# Altium project BMW E34 Touring Bagage Light.PrjPcb
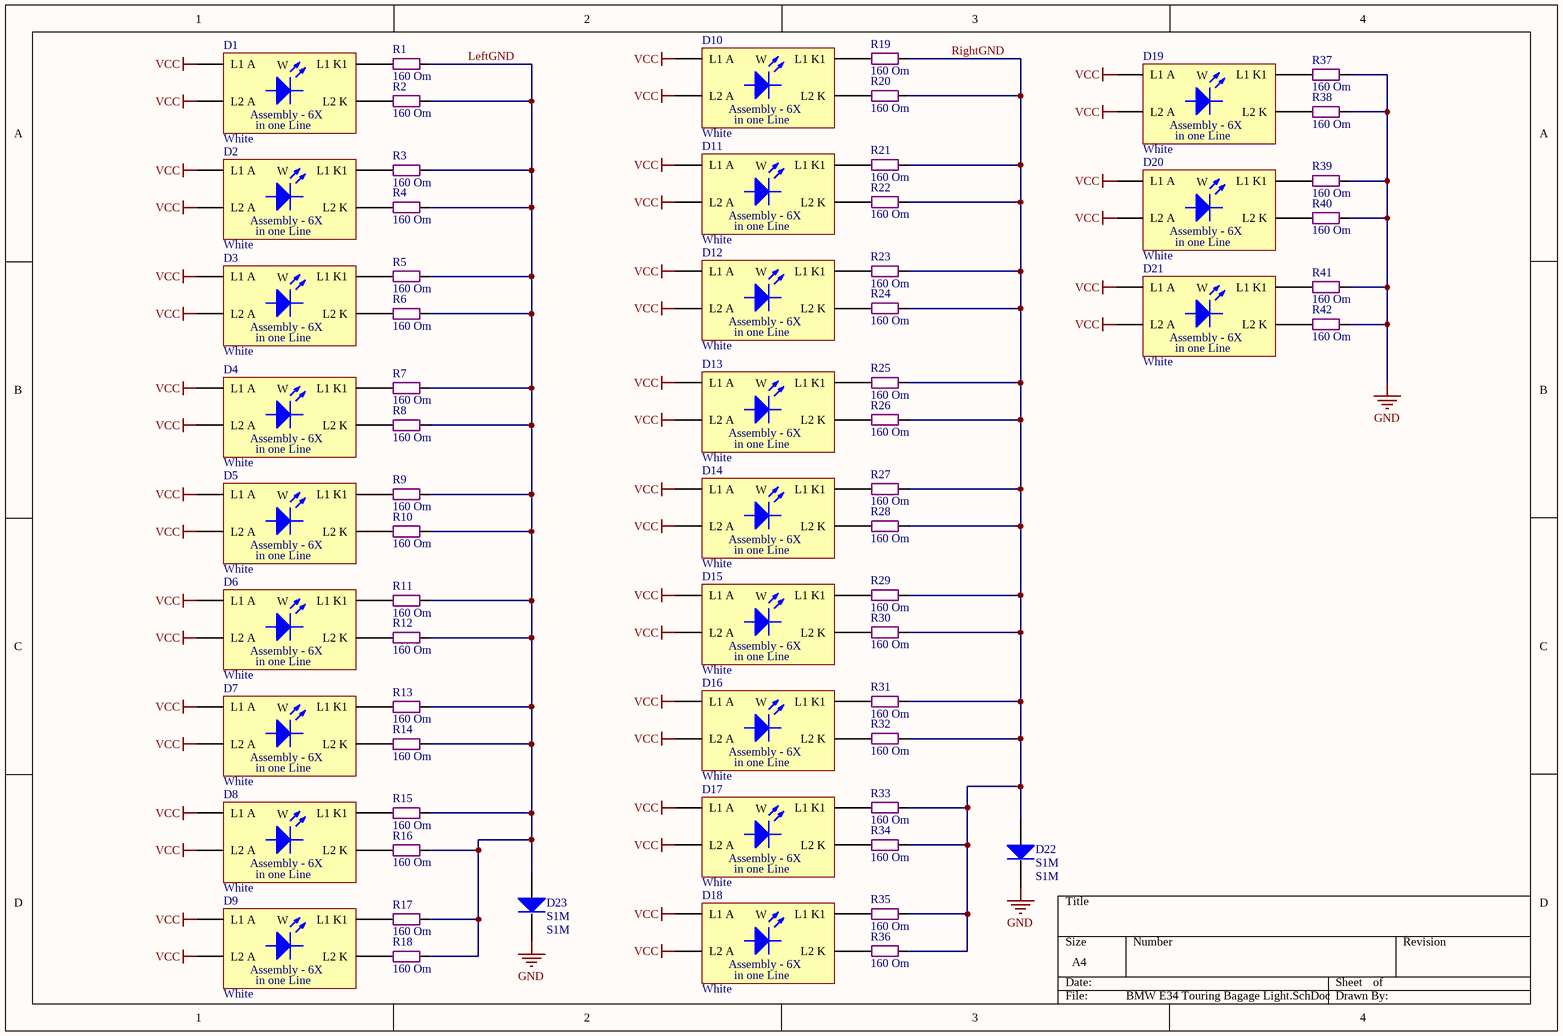
[diagram p0: BMW E34 Touring Bagage Light.SchDoc]
1 sheet, 65 parts. Net scope: global (net labels, ports and power ports of the same name join across sheets).
Board files: BMW E34 Touring Bagage Light 41x180mm.PcbDoc, BMW E34 Touring Bagage Light.PcbDoc

## Sheet BMW E34 Touring Bagage Light.SchDoc
size A4

### Parts
D1  White  [LED Assembly Round 5mm White 6X 0.5mm]
D2  White  [LED Assembly Round 5mm White 6X 0.5mm]
D3  White  [LED Assembly Round 5mm White 6X 0.5mm]
D4  White  [LED Assembly Round 5mm White 6X 0.5mm]
D5  White  [LED Assembly Round 5mm White 6X]
D6  White  [LED Assembly Round 5mm White 6X]
D7  White  [LED Assembly Round 5mm White 6X 0.5mm]
D8  White  [LED Assembly Round 5mm White 6X 0.5mm]
D9  White  [LED Assembly Round 5mm White 6X 0.5mm]
D10  White  [LED Assembly Round 5mm White 6X 0.5mm]
D11  White  [LED Assembly Round 5mm White 6X 0.5mm]
D12  White  [LED Assembly Round 5mm White 6X 0.5mm]
D13  White  [LED Assembly Round 5mm White 6X]
D14  White  [LED Assembly Round 5mm White 6X]
D15  White  [LED Assembly Round 5mm White 6X 0.5mm]
D16  White  [LED Assembly Round 5mm White 6X 0.5mm]
D17  White  [LED Assembly Round 5mm White 6X 0.5mm]
D18  White  [LED Assembly Round 5mm White 6X 0.5mm]
D19  White  [LED Assembly Round 5mm White 2X3 1mm]
D20  White  [LED Assembly Round 5mm White 2X3 1mm]
D21  White  [LED Assembly Round 5mm White 2X3 1mm]
D22  S1M  [DO-214AC]
D23  S1M  [DO-214AC]
R1  160 Om  [SMD 0603 (1608)]
R2  160 Om  [SMD 0603 (1608)]
R3  160 Om  [SMD 0603 (1608)]
R4  160 Om  [SMD 0603 (1608)]
R5  160 Om  [SMD 0603 (1608)]
R6  160 Om  [SMD 0603 (1608)]
R7  160 Om  [SMD 0603 (1608)]
R8  160 Om  [SMD 0603 (1608)]
R9  160 Om  [SMD 0603 (1608)]
R10  160 Om  [SMD 0603 (1608)]
R11  160 Om  [SMD 0603 (1608)]
R12  160 Om  [SMD 0603 (1608)]
R13  160 Om  [SMD 0603 (1608)]
R14  160 Om  [SMD 0603 (1608)]
R15  160 Om  [SMD 0603 (1608)]
R16  160 Om  [SMD 0603 (1608)]
R17  160 Om  [SMD 0603 (1608)]
R18  160 Om  [SMD 0603 (1608)]
R19  160 Om  [SMD 0603 (1608)]
R20  160 Om  [SMD 0603 (1608)]
R21  160 Om  [SMD 0603 (1608)]
R22  160 Om  [SMD 0603 (1608)]
R23  160 Om  [SMD 0603 (1608)]
R24  160 Om  [SMD 0603 (1608)]
R25  160 Om  [SMD 0603 (1608)]
R26  160 Om  [SMD 0603 (1608)]
R27  160 Om  [SMD 0603 (1608)]
R28  160 Om  [SMD 0603 (1608)]
R29  160 Om  [SMD 0603 (1608)]
R30  160 Om  [SMD 0603 (1608)]
R31  160 Om  [SMD 0603 (1608)]
R32  160 Om  [SMD 0603 (1608)]
R33  160 Om  [SMD 0603 (1608)]
R34  160 Om  [SMD 0603 (1608)]
R35  160 Om  [SMD 0603 (1608)]
R36  160 Om  [SMD 0603 (1608)]
R37  160 Om  [SMD 0603 (1608)]
R38  160 Om  [SMD 0603 (1608)]
R39  160 Om  [SMD 0603 (1608)]
R40  160 Om  [SMD 0603 (1608)]
R41  160 Om  [SMD 0603 (1608)]
R42  160 Om  [SMD 0603 (1608)]

### Nets
GND: D22.K D23.K R37.2 R38.2 R39.2 R40.2 R41.2 R42.2
VCC: D1.A1(L1_A) D1.A2(L2_A) D2.A1(L1_A) D2.A2(L2_A) D3.A1(L1_A) D3.A2(L2_A) D4.A1(L1_A) D4.A2(L2_A) D5.A1(L1_A) D5.A2(L2_A) D6.A1(L1_A) D6.A2(L2_A) D7.A1(L1_A) D7.A2(L2_A) D8.A1(L1_A) D8.A2(L2_A) D9.A1(L1_A) D9.A2(L2_A) D10.A1(L1_A) D10.A2(L2_A) D11.A1(L1_A) D11.A2(L2_A) D12.A1(L1_A) D12.A2(L2_A) D13.A1(L1_A) D13.A2(L2_A) D14.A1(L1_A) D14.A2(L2_A) D15.A1(L1_A) D15.A2(L2_A) D16.A1(L1_A) D16.A2(L2_A) D17.A1(L1_A) D17.A2(L2_A) D18.A1(L1_A) D18.A2(L2_A) D19.A1(L1_A) D19.A2(L2_A) D20.A1(L1_A) D20.A2(L2_A) D21.A1(L1_A) D21.A2(L2_A)
LeftGND: D23.A R1.2 R2.2 R3.2 R4.2 R5.2 R6.2 R7.2 R8.2 R9.2 R10.2 R11.2 R12.2 R13.2 R14.2 R15.2 R16.2 R17.2 R18.2
RightGND: D22.A R19.2 R20.2 R21.2 R22.2 R23.2 R24.2 R25.2 R26.2 R27.2 R28.2 R29.2 R30.2 R31.2 R32.2 R33.2 R34.2 R35.2 R36.2
NetD1_K1: D1.K1(L1_K1) R1.1
NetD1_K2: D1.K2(L2_K) R2.1
NetD2_K1: D2.K1(L1_K1) R3.1
NetD2_K2: D2.K2(L2_K) R4.1
NetD3_K1: D3.K1(L1_K1) R5.1
NetD3_K2: D3.K2(L2_K) R6.1
NetD4_K1: D4.K1(L1_K1) R7.1
NetD4_K2: D4.K2(L2_K) R8.1
NetD5_K1: D5.K1(L1_K1) R9.1
NetD5_K2: D5.K2(L2_K) R10.1
NetD6_K1: D6.K1(L1_K1) R11.1
NetD6_K2: D6.K2(L2_K) R12.1
NetD7_K1: D7.K1(L1_K1) R13.1
NetD7_K2: D7.K2(L2_K) R14.1
NetD8_K1: D8.K1(L1_K1) R15.1
NetD8_K2: D8.K2(L2_K) R16.1
NetD9_K1: D9.K1(L1_K1) R17.1
NetD9_K2: D9.K2(L2_K) R18.1
NetD10_K1: D10.K1(L1_K1) R19.1
NetD10_K2: D10.K2(L2_K) R20.1
NetD11_K1: D11.K1(L1_K1) R21.1
NetD11_K2: D11.K2(L2_K) R22.1
NetD12_K1: D12.K1(L1_K1) R23.1
NetD12_K2: D12.K2(L2_K) R24.1
NetD13_K1: D13.K1(L1_K1) R25.1
NetD13_K2: D13.K2(L2_K) R26.1
NetD14_K1: D14.K1(L1_K1) R27.1
NetD14_K2: D14.K2(L2_K) R28.1
NetD15_K1: D15.K1(L1_K1) R29.1
NetD15_K2: D15.K2(L2_K) R30.1
NetD16_K1: D16.K1(L1_K1) R31.1
NetD16_K2: D16.K2(L2_K) R32.1
NetD17_K1: D17.K1(L1_K1) R33.1
NetD17_K2: D17.K2(L2_K) R34.1
NetD18_K1: D18.K1(L1_K1) R35.1
NetD18_K2: D18.K2(L2_K) R36.1
NetD19_K1: D19.K1(L1_K1) R37.1
NetD19_K2: D19.K2(L2_K) R38.1
NetD20_K1: D20.K1(L1_K1) R39.1
NetD20_K2: D20.K2(L2_K) R40.1
NetD21_K1: D21.K1(L1_K1) R41.1
NetD21_K2: D21.K2(L2_K) R42.1

### Notes on the sheet
- (in symbol Led Assembly Round 5mm White 6X) W; Assembly - 6X; in one Line

### Library data of the parts
D1-D21 = Led Assembly Round 5mm White 6X: 3.2-3.4v 25mA, 16-20cd; Forward Voltage Min: 3.2; Forward Voltage TYP: 3.4; Wave len min/typ: 5000/6500; Liminous Min (mcd): 16000; Liminous Typ (mcd): 20000; Forward Amp (mA): 25; Color: White
D22 D23 = Diode S1M: 1 Amp General Purpose Rectifier; Maximum Repetitive Reverse Voltage: 1000V; IF(AV) Average Rectified Forward Current: 1A; PackageReference: DO-214AC; VALUE: S1M
R1-R42 = Res SMD 0603